# EAGLE schematic KAC12040_sfe_v0.3 (EAGLE 6.5.2)

## Sheet 1 of 6
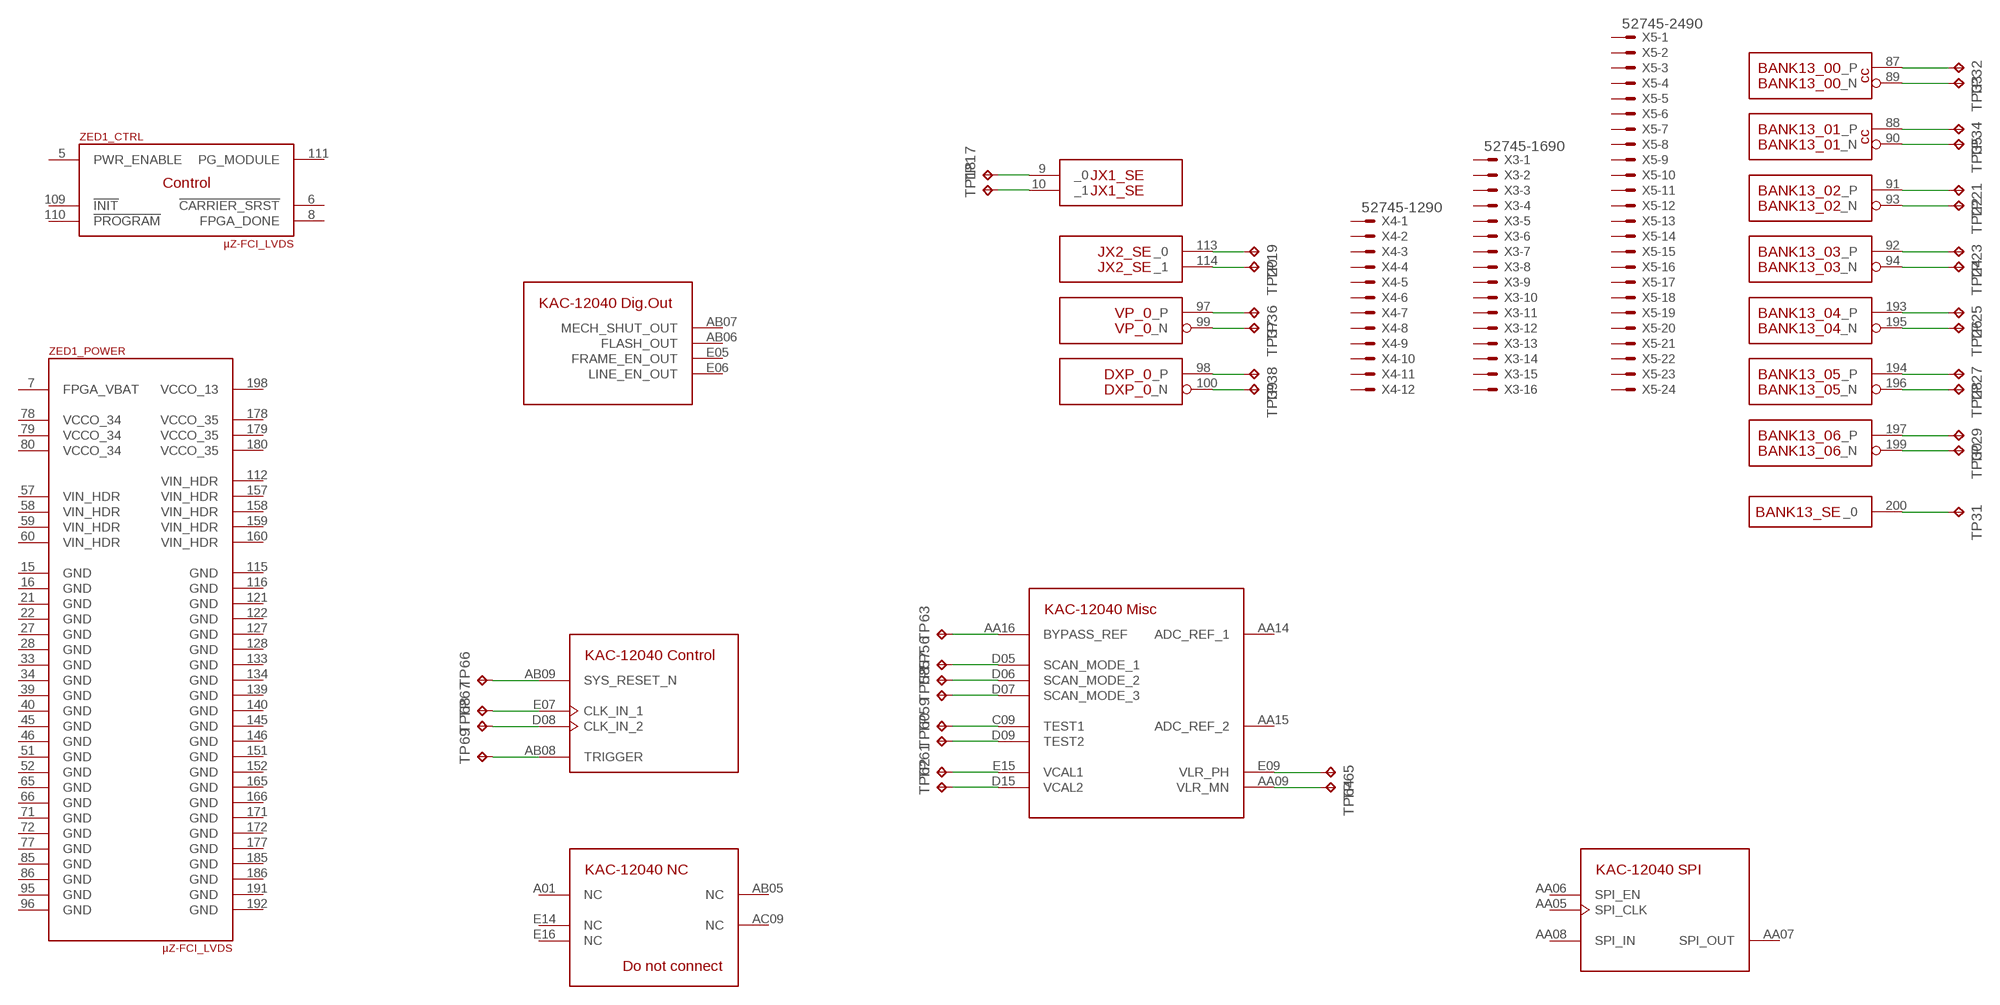
[diagram p0: schematic, sheet 1]

### Parts
TP17  TPPAD1-13  [P1-13]
TP18  TPPAD1-13  [P1-13]
TP19  TPPAD1-13  [P1-13]
TP20  TPPAD1-13  [P1-13]
TP21  TPTP08SQ  [TP08SQ]
TP22  TPTP08SQ  [TP08SQ]
TP23  TPTP08SQ  [TP08SQ]
TP24  TPTP08SQ  [TP08SQ]
TP25  TPTP08SQ  [TP08SQ]
TP26  TPTP08SQ  [TP08SQ]
TP27  TPTP08SQ  [TP08SQ]
TP28  TPTP08SQ  [TP08SQ]
TP29  TPTP08SQ  [TP08SQ]
TP30  TPTP08SQ  [TP08SQ]
TP31  TPPAD1-13  [P1-13]
TP32  TPTP18SQ  [TP18SQ]
TP33  TPTP18SQ  [TP18SQ]
TP34  TPTP18SQ  [TP18SQ]
TP35  TPTP18SQ  [TP18SQ]
TP36  TPPAD1-13Y  [P1-13Y]
TP37  TPPAD1-13Y  [P1-13Y]
TP38  TPPAD1-13Y  [P1-13Y]
TP39  TPPAD1-13Y  [P1-13Y]
TP56  TPTP15SQ  [TP15SQ]
TP57  TPTP15SQ  [TP15SQ]
TP58  TPTP15SQ  [TP15SQ]
TP59  TPTP15SQ  [TP15SQ]
TP60  TPTP15SQ  [TP15SQ]
TP61  TPTP15SQ  [TP15SQ]
TP62  TPTP15SQ  [TP15SQ]
TP63  TPTP15SQ  [TP15SQ]
TP64  TPTP15SQ  [TP15SQ]
TP65  TPTP15SQ  [TP15SQ]
TP66  TPTP15R  [TP15R]
TP67  TPTP15R  [TP15R]
TP68  TPTP15R  [TP15R]
TP69  TPTP15R  [TP15R]
U$1  KAC-12040-RB501T4  [KAC-12040-RB501T4]
X3  52745-1690  [52745-1690]
X4  52745-1290  [52745-1290]
X5  52745-2490  [52745-2490]
ZED1  µZ-FCI_LVDS  [µZ]

### Nets
N$1 [LVDS]: TP62.TP U$1.D15(_MISC:VCAL2)
N$2 [LVDS]: TP61.TP U$1.E15(_MISC:VCAL1)
N$3 [LVDS]: TP60.TP U$1.D09(_MISC:TEST2)
N$4 [LVDS]: TP59.TP U$1.C09(_MISC:TEST1)
N$42 [LVDS]: TP19.TP ZED1.113(JX2_SE:_0)
N$43 [LVDS]: TP20.TP ZED1.114(JX2_SE:_1)
N$44 [LVDS]: TP17.TP ZED1.9(JX1_SE:_0)
N$45 [LVDS]: TP18.TP ZED1.10(JX1_SE:_1)
N$46 [LVDS]: TP21.TP ZED1.91(BANK13_02:_P)
N$47 [LVDS]: TP22.TP ZED1.93(BANK13_02:_N)
N$48 [LVDS]: TP23.TP ZED1.92(BANK13_03:_P)
N$49 [LVDS]: TP24.TP ZED1.94(BANK13_03:_N)
N$50 [LVDS]: TP25.TP ZED1.193(BANK13_04:_P)
N$51 [LVDS]: TP26.TP ZED1.195(BANK13_04:_N)
N$52 [LVDS]: TP27.TP ZED1.194(BANK13_05:_P)
N$53 [LVDS]: TP28.TP ZED1.196(BANK13_05:_N)
N$54 [LVDS]: TP29.TP ZED1.197(BANK13_06:_P)
N$55 [LVDS]: TP30.TP ZED1.199(BANK13_06:_N)
N$56 [LVDS]: TP31.TP ZED1.200(BANK13_SE:_0)
N$57 [LVDS]: TP32.TP ZED1.87(BANK13_00:_P)
N$58 [LVDS]: TP33.TP ZED1.89(BANK13_00:_N)
N$59 [LVDS]: TP34.TP ZED1.88(BANK13_01:_P)
N$60 [LVDS]: TP35.TP ZED1.90(BANK13_01:_N)
N$61 [LVDS]: TP36.TP ZED1.97(VP_0:_P)
N$62 [LVDS]: TP37.TP ZED1.99(VP_0:_N)
N$63 [LVDS]: TP38.TP ZED1.98(DXP_0:_P)
N$64 [LVDS]: TP39.TP ZED1.100(DXP_0:_N)
N$65 [LVDS]: TP58.TP U$1.D07(_MISC:SCAN_MODE_3)
N$66 [LVDS]: TP57.TP U$1.D06(_MISC:SCAN_MODE_2)
N$67 [LVDS]: TP56.TP U$1.D05(_MISC:SCAN_MODE_1)
N$84 [LVDS]: TP63.TP U$1.AA16(_MISC:BYPASS_REF)
N$85 [LVDS]: TP65.TP U$1.E09(_MISC:VLR_PH)
N$86 [LVDS]: TP64.TP U$1.AA09(_MISC:VLR_MN)
N$87 [LVDS]: TP66.TP U$1.AB09(_CTRL:SYS_RESET_N)
N$88 [LVDS]: TP67.TP U$1.E07(_CTRL:CLK_IN_1)
N$89 [LVDS]: TP68.TP U$1.D08(_CTRL:CLK_IN_2)
N$90 [LVDS]: TP69.TP U$1.AB08(_CTRL:TRIGGER)
Unconnected: U$1.A01(_NC:NC) U$1.A15(_BANK5:LVDS_0_P) U$1.A16(_BANK5:LVDS_1_P) U$1.A17(_BANK5:LVDS_2_P) U$1.A18(_BANK5:LVDS_3_P) U$1.A19(_BANK5:LVDS_4_P) U$1.A20(_BANK5:LVDS_5_P) U$1.A21(_BANK5:LVDS_6_P) U$1.A22(_BANK7:CLK_P) U$1.A23(_BANK7:LVDS_0_P) U$1.A24(_BANK7:LVDS_1_P) U$1.A25(_BANK7:LVDS_2_P) U$1.AA05(_SPI:SPI_CLK) U$1.AA06(_SPI:SPI_EN) U$1.AA07(_SPI:SPI_OUT) U$1.AA08(_SPI:SPI_IN) U$1.AA14(_MISC:ADC_REF_1) U$1.AA15(_MISC:ADC_REF_2) U$1.AA26(_BANK6:LVDS_6_P) U$1.AA27(_BANK6:LVDS_6_N) U$1.AB05(_NC:NC) U$1.AB06(_DIGOUT:FLASH_OUT) U$1.AB07(_DIGOUT:MECH_SHUT_OUT) U$1.AB26(_BANK6:LVDS_5_P) U$1.AB27(_BANK6:LVDS_5_N) U$1.AC09(_NC:NC) U$1.AC15(_BANK4:CLK_P) U$1.AC16(_BANK4:CLK_N) U$1.AC26(_BANK6:LVDS_4_P) U$1.AC27(_BANK6:LVDS_4_N) U$1.AD15(_BANK4:LVDS_0_N) U$1.AD16(_BANK4:LVDS_1_N) U$1.AD17(_BANK4:LVDS_2_N) U$1.AD18(_BANK4:LVDS_3_N) U$1.AD19(_BANK4:LVDS_4_N) U$1.AD20(_BANK4:LVDS_5_N) U$1.AD21(_BANK4:LVDS_6_N) U$1.AD22(_BANK6:CLK_N) U$1.AD23(_BANK6:LVDS_0_N) U$1.AD24(_BANK6:LVDS_1_N) U$1.AD25(_BANK6:LVDS_2_N) U$1.AD26(_BANK6:LVDS_3_P) U$1.AD27(_BANK6:LVDS_3_N) U$1.AE15(_BANK4:LVDS_0_P) U$1.AE16(_BANK4:LVDS_1_P) U$1.AE17(_BANK4:LVDS_2_P) U$1.AE18(_BANK4:LVDS_3_P) U$1.AE19(_BANK4:LVDS_4_P) U$1.AE20(_BANK4:LVDS_5_P) U$1.AE21(_BANK4:LVDS_6_P) U$1.AE22(_BANK6:CLK_P) U$1.AE23(_BANK6:LVDS_0_P) U$1.AE24(_BANK6:LVDS_1_P) U$1.AE25(_BANK6:LVDS_2_P) U$1.B15(_BANK5:LVDS_0_N) U$1.B16(_BANK5:LVDS_1_N) U$1.B17(_BANK5:LVDS_2_N) U$1.B18(_BANK5:LVDS_3_N) U$1.B19(_BANK5:LVDS_4_N) U$1.B20(_BANK5:LVDS_5_N) U$1.B21(_BANK5:LVDS_6_N) U$1.B22(_BANK7:CLK_N) U$1.B23(_BANK7:LVDS_0_N) U$1.B24(_BANK7:LVDS_1_N) U$1.B25(_BANK7:LVDS_2_N) U$1.B26(_BANK7:LVDS_3_N) U$1.B27(_BANK7:LVDS_3_P) U$1.C15(_BANK5:CLK_P) U$1.C16(_BANK5:CLK_N) U$1.C26(_BANK7:LVDS_4_N) U$1.C27(_BANK7:LVDS_4_P) U$1.D26(_BANK7:LVDS_5_N) U$1.D27(_BANK7:LVDS_5_P) U$1.E05(_DIGOUT:FRAME_EN_OUT) U$1.E06(_DIGOUT:LINE_EN_OUT) U$1.E14(_NC:NC) U$1.E16(_NC:NC) U$1.E26(_BANK7:LVDS_6_N) U$1.E27(_BANK7:LVDS_6_P) X3.1 X3.2 X3.3 X3.4 X3.5 X3.6 X3.7 X3.8 X3.9 X3.10 X3.11 X3.12 X3.13 X3.14 X3.15 X3.16 X4.1 X4.2 X4.3 X4.4 X4.5 X4.6 X4.7 X4.8 X4.9 X4.10 X4.11 X4.12 X5.1 X5.2 X5.3 X5.4 X5.5 X5.6 X5.7 X5.8 X5.9 X5.10 X5.11 X5.12 X5.13 X5.14 X5.15 X5.16 X5.17 X5.18 X5.19 X5.20 X5.21 X5.22 X5.23 X5.24 ZED1.5(_CTRL:PWR_ENABLE) ZED1.6(_CTRL:!CARRIER_SRST) ZED1.8(_CTRL:FPGA_DONE) ZED1.109(_CTRL:!INIT) ZED1.110(_CTRL:!PROGRAM) ZED1.111(_CTRL:PG_MODULE)

## Sheet 2 of 6
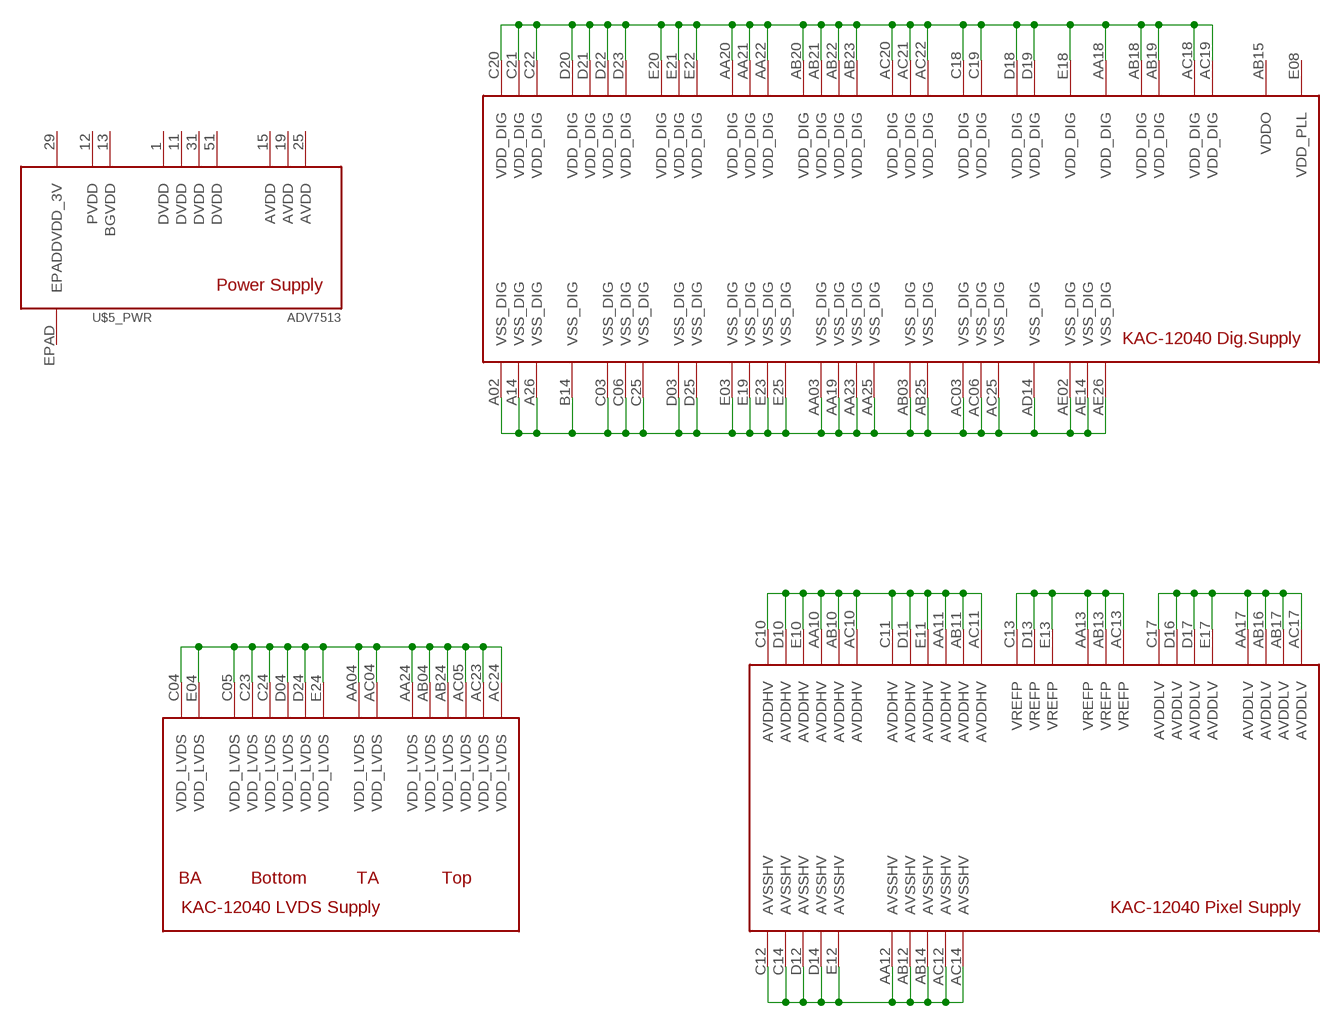
[diagram p1: schematic, sheet 2]

### Parts
U$5  ADV7513  [LQFP-ST-64-2]

### Nets
AVDD_HV: U$1.AA10(_PWR_PIXEL:AVDDHV) U$1.AA11(_PWR_PIXEL:AVDDHV) U$1.AB10(_PWR_PIXEL:AVDDHV) U$1.AB11(_PWR_PIXEL:AVDDHV) U$1.AC10(_PWR_PIXEL:AVDDHV) U$1.AC11(_PWR_PIXEL:AVDDHV) U$1.C10(_PWR_PIXEL:AVDDHV) U$1.C11(_PWR_PIXEL:AVDDHV) U$1.D10(_PWR_PIXEL:AVDDHV) U$1.D11(_PWR_PIXEL:AVDDHV) U$1.E10(_PWR_PIXEL:AVDDHV) U$1.E11(_PWR_PIXEL:AVDDHV)
AVDD_LV: U$1.AA17(_PWR_PIXEL:AVDDLV) U$1.AB16(_PWR_PIXEL:AVDDLV) U$1.AB17(_PWR_PIXEL:AVDDLV) U$1.AC17(_PWR_PIXEL:AVDDLV) U$1.C17(_PWR_PIXEL:AVDDLV) U$1.D16(_PWR_PIXEL:AVDDLV) U$1.D17(_PWR_PIXEL:AVDDLV) U$1.E17(_PWR_PIXEL:AVDDLV)
AVSS_HV: U$1.AA12(_PWR_PIXEL:AVSSHV) U$1.AB12(_PWR_PIXEL:AVSSHV) U$1.AB14(_PWR_PIXEL:AVSSHV) U$1.AC12(_PWR_PIXEL:AVSSHV) U$1.AC14(_PWR_PIXEL:AVSSHV) U$1.C12(_PWR_PIXEL:AVSSHV) U$1.C14(_PWR_PIXEL:AVSSHV) U$1.D12(_PWR_PIXEL:AVSSHV) U$1.D14(_PWR_PIXEL:AVSSHV) U$1.E12(_PWR_PIXEL:AVSSHV)
VDD_DIG: U$1.AA18(_PWR_DIG:VDD_DIG) U$1.AA20(_PWR_DIG:VDD_DIG) U$1.AA21(_PWR_DIG:VDD_DIG) U$1.AA22(_PWR_DIG:VDD_DIG) U$1.AB18(_PWR_DIG:VDD_DIG) U$1.AB19(_PWR_DIG:VDD_DIG) U$1.AB20(_PWR_DIG:VDD_DIG) U$1.AB21(_PWR_DIG:VDD_DIG) U$1.AB22(_PWR_DIG:VDD_DIG) U$1.AB23(_PWR_DIG:VDD_DIG) U$1.AC18(_PWR_DIG:VDD_DIG) U$1.AC19(_PWR_DIG:VDD_DIG) U$1.AC20(_PWR_DIG:VDD_DIG) U$1.AC21(_PWR_DIG:VDD_DIG) U$1.AC22(_PWR_DIG:VDD_DIG) U$1.C18(_PWR_DIG:VDD_DIG) U$1.C19(_PWR_DIG:VDD_DIG) U$1.C20(_PWR_DIG:VDD_DIG) U$1.C21(_PWR_DIG:VDD_DIG) U$1.C22(_PWR_DIG:VDD_DIG) U$1.D18(_PWR_DIG:VDD_DIG) U$1.D19(_PWR_DIG:VDD_DIG) U$1.D20(_PWR_DIG:VDD_DIG) U$1.D21(_PWR_DIG:VDD_DIG) U$1.D22(_PWR_DIG:VDD_DIG) U$1.D23(_PWR_DIG:VDD_DIG) U$1.E18(_PWR_DIG:VDD_DIG) U$1.E20(_PWR_DIG:VDD_DIG) U$1.E21(_PWR_DIG:VDD_DIG) U$1.E22(_PWR_DIG:VDD_DIG)
VDD_LVDS: U$1.AA04(_PWR_LVDS:VDD_LVDS) U$1.AA24(_PWR_LVDS:VDD_LVDS) U$1.AB04(_PWR_LVDS:VDD_LVDS) U$1.AB24(_PWR_LVDS:VDD_LVDS) U$1.AC04(_PWR_LVDS:VDD_LVDS) U$1.AC05(_PWR_LVDS:VDD_LVDS) U$1.AC23(_PWR_LVDS:VDD_LVDS) U$1.AC24(_PWR_LVDS:VDD_LVDS) U$1.C04(_PWR_LVDS:VDD_LVDS) U$1.C05(_PWR_LVDS:VDD_LVDS) U$1.C23(_PWR_LVDS:VDD_LVDS) U$1.C24(_PWR_LVDS:VDD_LVDS) U$1.D04(_PWR_LVDS:VDD_LVDS) U$1.D24(_PWR_LVDS:VDD_LVDS) U$1.E04(_PWR_LVDS:VDD_LVDS) U$1.E24(_PWR_LVDS:VDD_LVDS)
VREFP: U$1.AA13(_PWR_PIXEL:VREFP) U$1.AB13(_PWR_PIXEL:VREFP) U$1.AC13(_PWR_PIXEL:VREFP) U$1.C13(_PWR_PIXEL:VREFP) U$1.D13(_PWR_PIXEL:VREFP) U$1.E13(_PWR_PIXEL:VREFP)
VSS_DIG: U$1.A02(_PWR_DIG:VSS_DIG) U$1.A14(_PWR_DIG:VSS_DIG) U$1.A26(_PWR_DIG:VSS_DIG) U$1.AA03(_PWR_DIG:VSS_DIG) U$1.AA19(_PWR_DIG:VSS_DIG) U$1.AA23(_PWR_DIG:VSS_DIG) U$1.AA25(_PWR_DIG:VSS_DIG) U$1.AB03(_PWR_DIG:VSS_DIG) U$1.AB25(_PWR_DIG:VSS_DIG) U$1.AC03(_PWR_DIG:VSS_DIG) U$1.AC06(_PWR_DIG:VSS_DIG) U$1.AC25(_PWR_DIG:VSS_DIG) U$1.AD14(_PWR_DIG:VSS_DIG) U$1.AE02(_PWR_DIG:VSS_DIG) U$1.AE14(_PWR_DIG:VSS_DIG) U$1.AE26(_PWR_DIG:VSS_DIG) U$1.B14(_PWR_DIG:VSS_DIG) U$1.C03(_PWR_DIG:VSS_DIG) U$1.C06(_PWR_DIG:VSS_DIG) U$1.C25(_PWR_DIG:VSS_DIG) U$1.D03(_PWR_DIG:VSS_DIG) U$1.D25(_PWR_DIG:VSS_DIG) U$1.E03(_PWR_DIG:VSS_DIG) U$1.E19(_PWR_DIG:VSS_DIG) U$1.E23(_PWR_DIG:VSS_DIG) U$1.E25(_PWR_DIG:VSS_DIG)

## Sheet 3 of 6
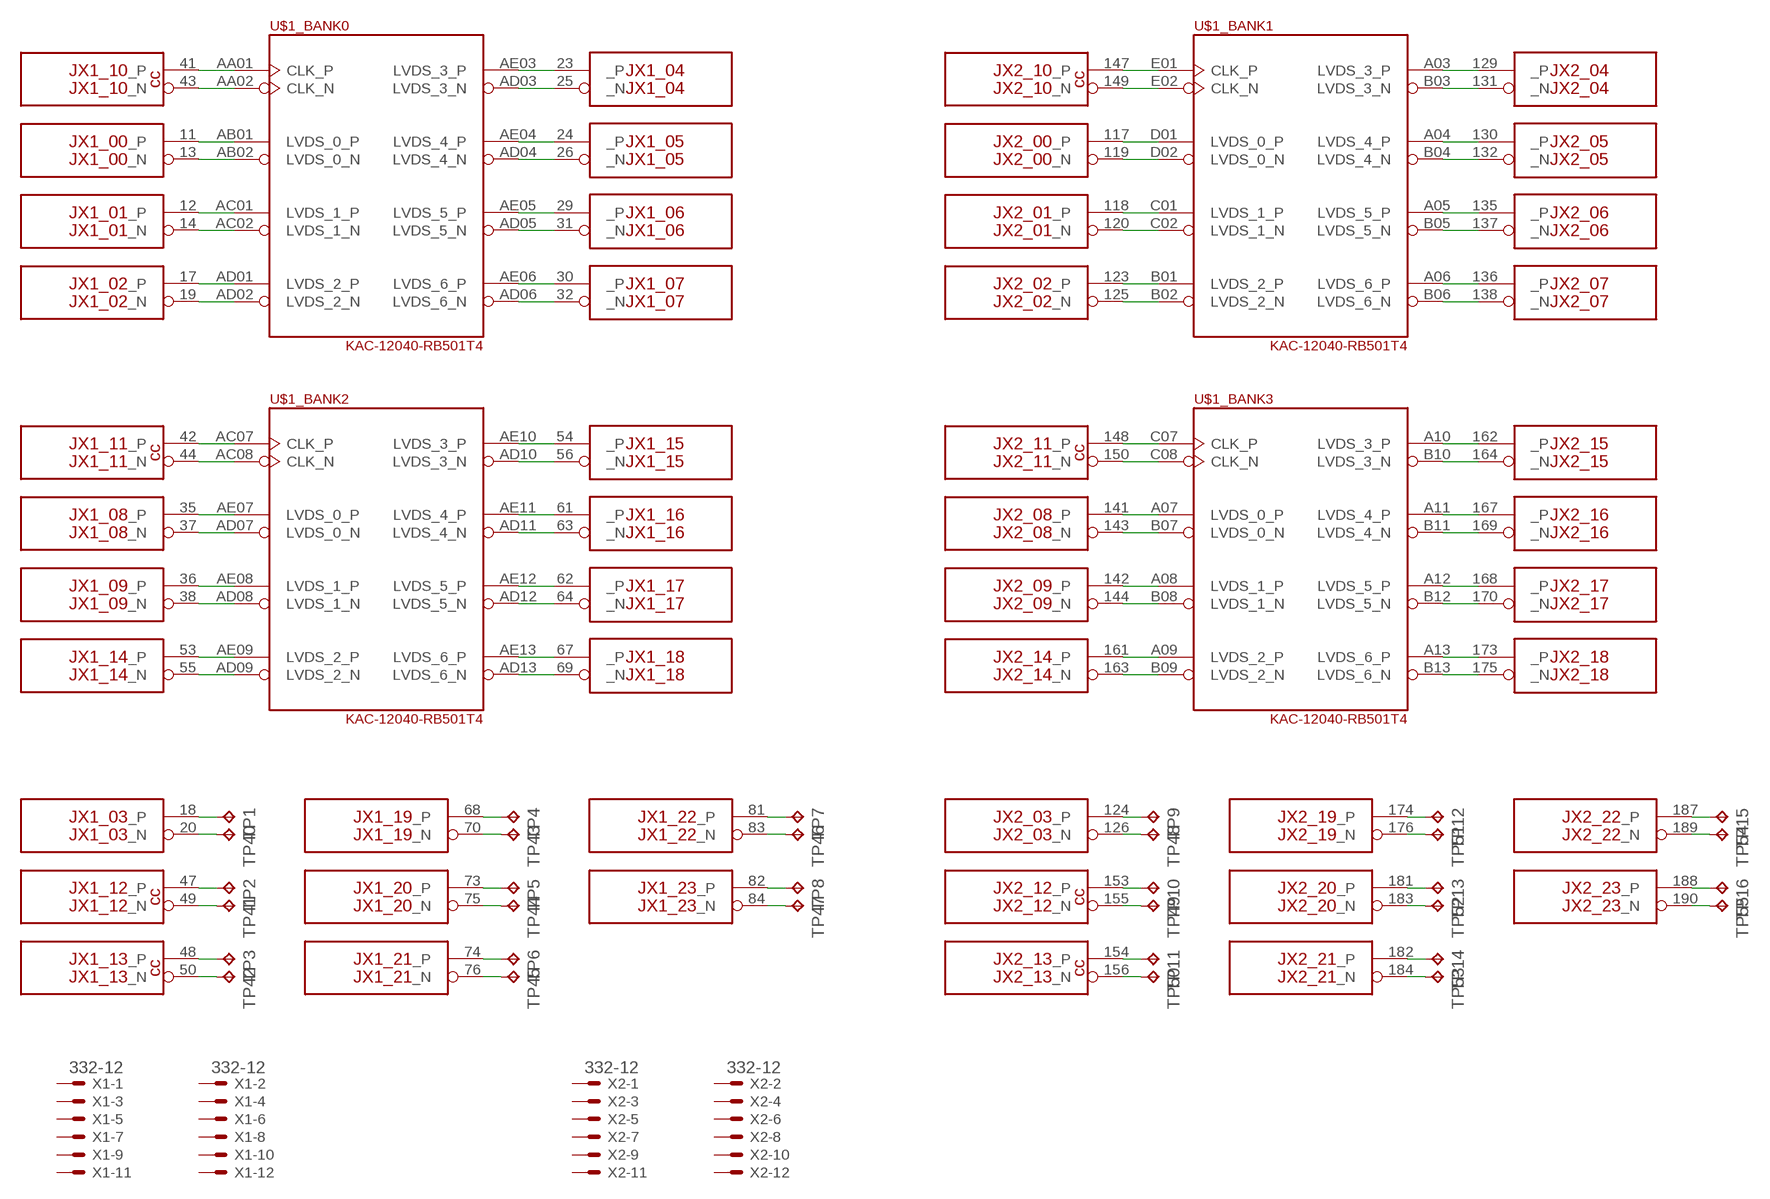
[diagram p2: schematic, sheet 3]

### Parts
TP1  TPTP10R  [TP10R]
TP2  TPTP20R  [TP20R]
TP3  TPTP20R  [TP20R]
TP4  TPTP10R  [TP10R]
TP5  TPTP10R  [TP10R]
TP6  TPTP10R  [TP10R]
TP7  TPTP10R  [TP10R]
TP8  TPTP10R  [TP10R]
TP9  TPTP10R  [TP10R]
TP10  TPTP20R  [TP20R]
TP11  TPTP20R  [TP20R]
TP12  TPTP10R  [TP10R]
TP13  TPTP10R  [TP10R]
TP14  TPTP10R  [TP10R]
TP15  TPTP10R  [TP10R]
TP16  TPTP10R  [TP10R]
TP40  TPTP10R  [TP10R]
TP41  TPTP20R  [TP20R]
TP42  TPTP20R  [TP20R]
TP43  TPTP10R  [TP10R]
TP44  TPTP10R  [TP10R]
TP45  TPTP10R  [TP10R]
TP46  TPTP10R  [TP10R]
TP47  TPTP10R  [TP10R]
TP48  TPTP10R  [TP10R]
TP49  TPTP20R  [TP20R]
TP50  TPTP20R  [TP20R]
TP51  TPTP10R  [TP10R]
TP52  TPTP10R  [TP10R]
TP53  TPTP10R  [TP10R]
TP54  TPTP10R  [TP10R]
TP55  TPTP10R  [TP10R]
X1  332-12  [332-12]
X2  332-12  [332-12]

### Nets
C$0_N [LVDS]: U$1.AA02(_BANK0:CLK_N) ZED1.43(JX1_10:_N)
C$0_P [LVDS]: U$1.AA01(_BANK0:CLK_P) ZED1.41(JX1_10:_P)
C$1_N [LVDS]: U$1.E02(_BANK1:CLK_N) ZED1.149(JX2_10:_N)
C$1_P [LVDS]: U$1.E01(_BANK1:CLK_P) ZED1.147(JX2_10:_P)
C$2_N [LVDS]: U$1.AC08(_BANK2:CLK_N) ZED1.44(JX1_11:_N)
C$2_P [LVDS]: U$1.AC07(_BANK2:CLK_P) ZED1.42(JX1_11:_P)
C$3_N [LVDS]: U$1.C08(_BANK3:CLK_N) ZED1.150(JX2_11:_N)
C$3_P [LVDS]: U$1.C07(_BANK3:CLK_P) ZED1.148(JX2_11:_P)
L0$0_N [LVDS]: U$1.AB02(_BANK0:LVDS_0_N) ZED1.13(JX1_00:_N)
L0$0_P [LVDS]: U$1.AB01(_BANK0:LVDS_0_P) ZED1.11(JX1_00:_P)
L0$1_N [LVDS]: U$1.D02(_BANK1:LVDS_0_N) ZED1.119(JX2_00:_N)
L0$1_P [LVDS]: U$1.D01(_BANK1:LVDS_0_P) ZED1.117(JX2_00:_P)
L0$2_N [LVDS]: U$1.AD07(_BANK2:LVDS_0_N) ZED1.37(JX1_08:_N)
L0$2_P [LVDS]: U$1.AE07(_BANK2:LVDS_0_P) ZED1.35(JX1_08:_P)
L0$3_N [LVDS]: U$1.B07(_BANK3:LVDS_0_N) ZED1.143(JX2_08:_N)
L0$3_P [LVDS]: U$1.A07(_BANK3:LVDS_0_P) ZED1.141(JX2_08:_P)
L1$0_N [LVDS]: U$1.AC02(_BANK0:LVDS_1_N) ZED1.14(JX1_01:_N)
L1$0_P [LVDS]: U$1.AC01(_BANK0:LVDS_1_P) ZED1.12(JX1_01:_P)
L1$1_N [LVDS]: U$1.C02(_BANK1:LVDS_1_N) ZED1.120(JX2_01:_N)
L1$1_P [LVDS]: U$1.C01(_BANK1:LVDS_1_P) ZED1.118(JX2_01:_P)
L1$2_N [LVDS]: U$1.AD08(_BANK2:LVDS_1_N) ZED1.38(JX1_09:_N)
L1$2_P [LVDS]: U$1.AE08(_BANK2:LVDS_1_P) ZED1.36(JX1_09:_P)
L1$3_N [LVDS]: U$1.B08(_BANK3:LVDS_1_N) ZED1.144(JX2_09:_N)
L1$3_P [LVDS]: U$1.A08(_BANK3:LVDS_1_P) ZED1.142(JX2_09:_P)
L2$0_N [LVDS]: U$1.AD02(_BANK0:LVDS_2_N) ZED1.19(JX1_02:_N)
L2$0_P [LVDS]: U$1.AD01(_BANK0:LVDS_2_P) ZED1.17(JX1_02:_P)
L2$1_N [LVDS]: U$1.B02(_BANK1:LVDS_2_N) ZED1.125(JX2_02:_N)
L2$1_P [LVDS]: U$1.B01(_BANK1:LVDS_2_P) ZED1.123(JX2_02:_P)
L2$2_N [LVDS]: U$1.AD09(_BANK2:LVDS_2_N) ZED1.55(JX1_14:_N)
L2$2_P [LVDS]: U$1.AE09(_BANK2:LVDS_2_P) ZED1.53(JX1_14:_P)
L2$3_N [LVDS]: U$1.B09(_BANK3:LVDS_2_N) ZED1.163(JX2_14:_N)
L2$3_P [LVDS]: U$1.A09(_BANK3:LVDS_2_P) ZED1.161(JX2_14:_P)
L3$0_N [LVDS]: U$1.AD03(_BANK0:LVDS_3_N) ZED1.25(JX1_04:_N)
L3$0_P [LVDS]: U$1.AE03(_BANK0:LVDS_3_P) ZED1.23(JX1_04:_P)
L3$1_N [LVDS]: U$1.B03(_BANK1:LVDS_3_N) ZED1.131(JX2_04:_N)
L3$1_P [LVDS]: U$1.A03(_BANK1:LVDS_3_P) ZED1.129(JX2_04:_P)
L3$2_N [LVDS]: U$1.AD10(_BANK2:LVDS_3_N) ZED1.56(JX1_15:_N)
L3$2_P [LVDS]: U$1.AE10(_BANK2:LVDS_3_P) ZED1.54(JX1_15:_P)
L3$3_N [LVDS]: U$1.B10(_BANK3:LVDS_3_N) ZED1.164(JX2_15:_N)
L3$3_P [LVDS]: U$1.A10(_BANK3:LVDS_3_P) ZED1.162(JX2_15:_P)
L4$0_N [LVDS]: U$1.AD04(_BANK0:LVDS_4_N) ZED1.26(JX1_05:_N)
L4$0_P [LVDS]: U$1.AE04(_BANK0:LVDS_4_P) ZED1.24(JX1_05:_P)
L4$1_N [LVDS]: U$1.B04(_BANK1:LVDS_4_N) ZED1.132(JX2_05:_N)
L4$1_P [LVDS]: U$1.A04(_BANK1:LVDS_4_P) ZED1.130(JX2_05:_P)
L4$2_N [LVDS]: U$1.AD11(_BANK2:LVDS_4_N) ZED1.63(JX1_16:_N)
L4$2_P [LVDS]: U$1.AE11(_BANK2:LVDS_4_P) ZED1.61(JX1_16:_P)
L4$3_N [LVDS]: U$1.B11(_BANK3:LVDS_4_N) ZED1.169(JX2_16:_N)
L4$3_P [LVDS]: U$1.A11(_BANK3:LVDS_4_P) ZED1.167(JX2_16:_P)
L5$0_N [LVDS]: U$1.AD05(_BANK0:LVDS_5_N) ZED1.31(JX1_06:_N)
L5$0_P [LVDS]: U$1.AE05(_BANK0:LVDS_5_P) ZED1.29(JX1_06:_P)
L5$1_N [LVDS]: U$1.B05(_BANK1:LVDS_5_N) ZED1.137(JX2_06:_N)
L5$1_P [LVDS]: U$1.A05(_BANK1:LVDS_5_P) ZED1.135(JX2_06:_P)
L5$2_N [LVDS]: U$1.AD12(_BANK2:LVDS_5_N) ZED1.64(JX1_17:_N)
L5$2_P [LVDS]: U$1.AE12(_BANK2:LVDS_5_P) ZED1.62(JX1_17:_P)
L5$3_N [LVDS]: U$1.B12(_BANK3:LVDS_5_N) ZED1.170(JX2_17:_N)
L5$3_P [LVDS]: U$1.A12(_BANK3:LVDS_5_P) ZED1.168(JX2_17:_P)
L6$0_N [LVDS]: U$1.AD06(_BANK0:LVDS_6_N) ZED1.32(JX1_07:_N)
L6$0_P [LVDS]: U$1.AE06(_BANK0:LVDS_6_P) ZED1.30(JX1_07:_P)
L6$1_N [LVDS]: U$1.B06(_BANK1:LVDS_6_N) ZED1.138(JX2_07:_N)
L6$1_P [LVDS]: U$1.A06(_BANK1:LVDS_6_P) ZED1.136(JX2_07:_P)
L6$2_N [LVDS]: U$1.AD13(_BANK2:LVDS_6_N) ZED1.69(JX1_18:_N)
L6$2_P [LVDS]: U$1.AE13(_BANK2:LVDS_6_P) ZED1.67(JX1_18:_P)
L6$3_N [LVDS]: U$1.B13(_BANK3:LVDS_6_N) ZED1.175(JX2_18:_N)
L6$3_P [LVDS]: U$1.A13(_BANK3:LVDS_6_P) ZED1.173(JX2_18:_P)
N$21 [LVDS]: TP15.TP ZED1.187(JX2_22:_P)
N$22 [LVDS]: TP12.TP ZED1.174(JX2_19:_P)
N$23 [LVDS]: TP9.TP ZED1.124(JX2_03:_P)
N$24 [LVDS]: TP7.TP ZED1.81(JX1_22:_P)
N$25 [LVDS]: TP4.TP ZED1.68(JX1_19:_P)
N$26 [LVDS]: TP1.TP ZED1.18(JX1_03:_P)
N$31 [LVDS]: TP2.TP ZED1.47(JX1_12:_P)
N$33 [LVDS]: TP3.TP ZED1.48(JX1_13:_P)
N$34 [LVDS]: TP5.TP ZED1.73(JX1_20:_P)
N$35 [LVDS]: TP6.TP ZED1.74(JX1_21:_P)
N$36 [LVDS]: TP8.TP ZED1.82(JX1_23:_P)
N$37 [LVDS]: TP10.TP ZED1.153(JX2_12:_P)
N$38 [LVDS]: TP11.TP ZED1.154(JX2_13:_P)
N$39 [LVDS]: TP13.TP ZED1.181(JX2_20:_P)
N$40 [LVDS]: TP14.TP ZED1.182(JX2_21:_P)
N$41 [LVDS]: TP16.TP ZED1.188(JX2_23:_P)
N$68 [LVDS]: TP40.TP ZED1.20(JX1_03:_N)
N$69 [LVDS]: TP41.TP ZED1.49(JX1_12:_N)
N$70 [LVDS]: TP42.TP ZED1.50(JX1_13:_N)
N$71 [LVDS]: TP43.TP ZED1.70(JX1_19:_N)
N$72 [LVDS]: TP44.TP ZED1.75(JX1_20:_N)
N$73 [LVDS]: TP45.TP ZED1.76(JX1_21:_N)
N$74 [LVDS]: TP46.TP ZED1.83(JX1_22:_N)
N$75 [LVDS]: TP47.TP ZED1.84(JX1_23:_N)
N$76 [LVDS]: TP48.TP ZED1.126(JX2_03:_N)
N$77 [LVDS]: TP49.TP ZED1.155(JX2_12:_N)
N$78 [LVDS]: TP50.TP ZED1.156(JX2_13:_N)
N$79 [LVDS]: TP51.TP ZED1.176(JX2_19:_N)
N$80 [LVDS]: TP52.TP ZED1.183(JX2_20:_N)
N$81 [LVDS]: TP53.TP ZED1.184(JX2_21:_N)
N$82 [LVDS]: TP54.TP ZED1.189(JX2_22:_N)
N$83 [LVDS]: TP55.TP ZED1.190(JX2_23:_N)
Unconnected: X1.1 X1.2 X1.3 X1.4 X1.5 X1.6 X1.7 X1.8 X1.9 X1.10 X1.11 X1.12 X2.1 X2.2 X2.3 X2.4 X2.5 X2.6 X2.7 X2.8 X2.9 X2.10 X2.11 X2.12

## Sheet 4 of 6
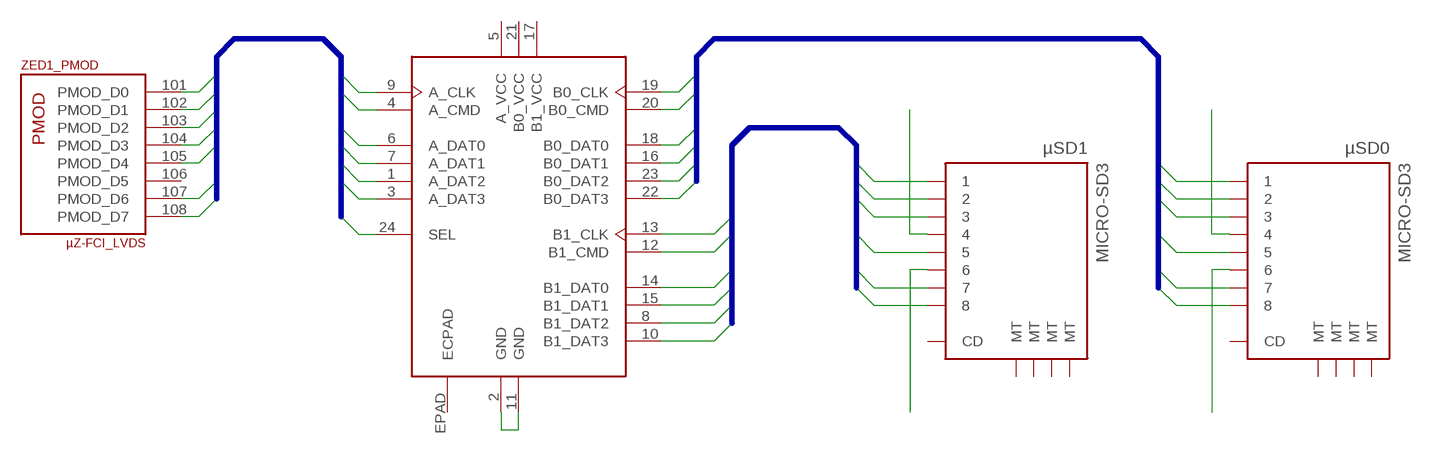
[diagram p3: schematic, sheet 4]

### Parts
U$4  TXS02612  [S-PWQFN-N24]
µSD0  MICRO-SD3  [TF-MICRO-SD_PP3]
µSD1  MICRO-SD3  [TF-MICRO-SD_PP3]

### Nets
A_CLK: U$4.9(A_CLK) ZED1.104(_PMOD:PMOD_D3)
A_CMD: U$4.4(A_CMD) ZED1.103(_PMOD:PMOD_D2)
A_DAT0: U$4.6(A_DAT0) ZED1.102(_PMOD:PMOD_D1)
A_DAT1: U$4.7(A_DAT1) ZED1.101(_PMOD:PMOD_D0)
A_DAT2: U$4.1(A_DAT2) ZED1.107(_PMOD:PMOD_D6)
A_DAT3: U$4.3(A_DAT3) ZED1.108(_PMOD:PMOD_D7)
B0_CLK: U$4.19(B0_CLK) µSD0.5
B0_CMD: U$4.20(B0_CMD) µSD0.3
B0_DAT0: U$4.18(B0_DAT0) µSD0.7
B0_DAT1: U$4.16(B0_DAT1) µSD0.8
B0_DAT2: U$4.23(B0_DAT2) µSD0.1
B0_DAT3: U$4.22(B0_DAT3) µSD0.2
B1_CLK: U$4.13(B1_CLK) µSD1.5
B1_CMD: U$4.12(B1_CMD) µSD1.3
B1_DAT0: U$4.14(B1_DAT0) µSD1.7
B1_DAT1: U$4.15(B1_DAT1) µSD1.8
B1_DAT2: U$4.8(B1_DAT2) µSD1.1
B1_DAT3: U$4.10(B1_DAT3) µSD1.2
N$5: µSD0.4
N$6: µSD0.6
N$7: µSD1.6
N$8: µSD1.4
N$30: U$4.2(GND) U$4.11(GND)
SEL: U$4.24(SEL) ZED1.105(_PMOD:PMOD_D4)
Unconnected: ZED1.106(_PMOD:PMOD_D5) µSD0.CD µSD1.CD

### Buses
B0_CLK,B0_CMD,B0_DAT[0..3]
B1_CLK,B1_CMD,B1_DAT[0..3]
A_CLK,A_CMD,A_DAT[0..3],SEL

## Sheet 5 of 6
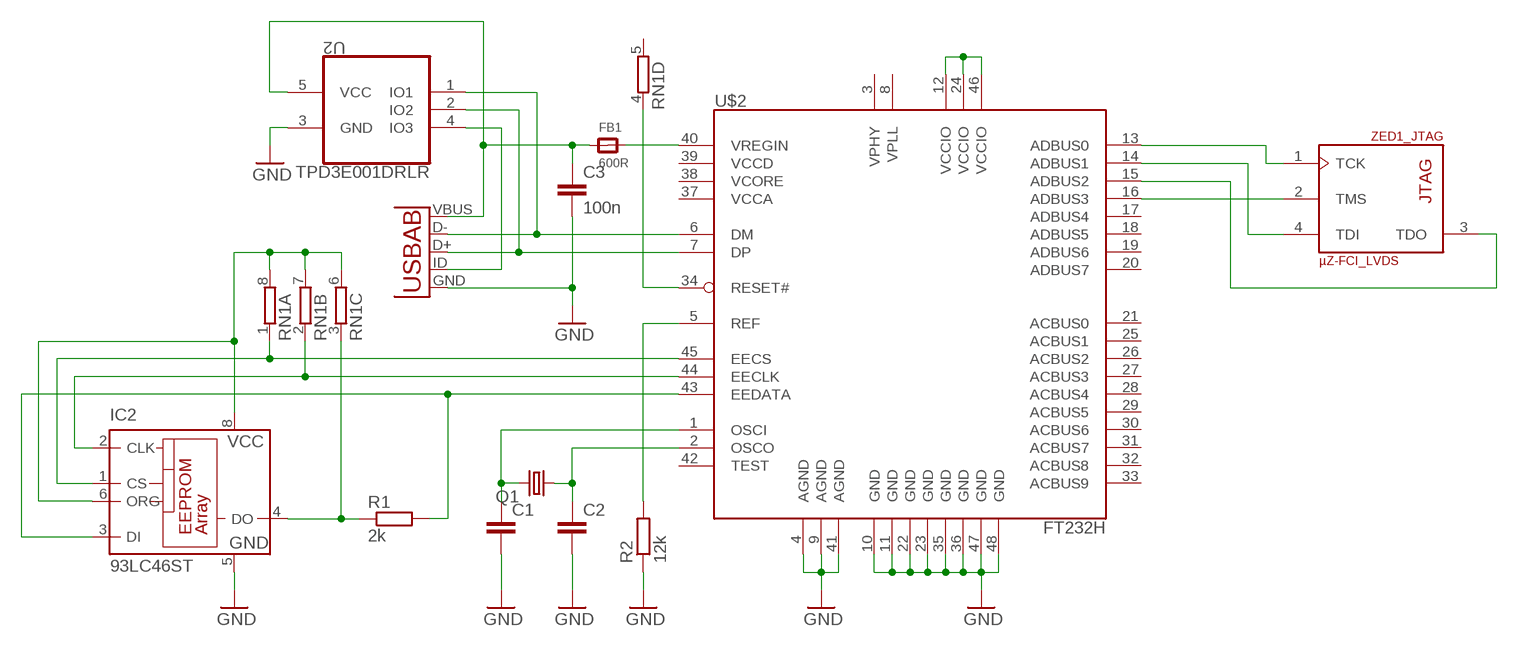
[diagram p4: schematic, sheet 5]

### Parts
C1  C-EUC0402K  [C0402K]
C2  C-EUC0402K  [C0402K]
C3  100n  C-EUC0402K  [C0402K]
FB1  600R  FERRITE_0603MP  [_0603MP]
IC2  93LC46ST  [TSSOP8]
Q1  CRYSTALCTS406  [CTS406]
R1  2k  R-EU_R0402  [R0402]
R2  12k  R-EU_R0402  [R0402]
RN1  4R-N0402ARV341  [4X0402ARV341]
U1  USB-AB  [USB-AB-MICRO-SMD]
U2  TPD3E001DRLR  [SOT50P160X60-5N]
U$2  FT232H  [LQFP48]

### Nets
EE_CLK: IC2.2(CLK) RN1.2 U$2.44(EECLK)
EE_CS: IC2.1(CS) RN1.1 U$2.45(EECS)
EE_DATA: IC2.3(DI) R1.2 U$2.43(EEDATA)
GND: C1.2 C2.2 C3.2 IC2.5(GND) R2.1 U1.GND U2.3(GND) U$2.4(AGND) U$2.9(AGND) U$2.10(GND) U$2.11(GND) U$2.22(GND) U$2.23(GND) U$2.35(GND) U$2.36(GND) U$2.41(AGND) U$2.47(GND) U$2.48(GND)
N$9: FB1.2 U$2.40(VREGIN)
N$10: C3.1 FB1.1 U1.VBUS U2.5(VCC)
N$11: IC2.4(DO) R1.1 RN1.3
N$12: IC2.6(ORG) IC2.8(VCC) RN1.6 RN1.7 RN1.8
N$13: U$2.13(ADBUS0) ZED1.1(_JTAG:TCK)
N$14: C1.1 Q1.3 U$2.1(OSCI)
N$15: C2.1 Q1.1 U$2.2(OSCO)
N$16: U$2.14(ADBUS1) ZED1.4(_JTAG:TDI)
N$17: U$2.15(ADBUS2) ZED1.3(_JTAG:TDO)
N$18: U$2.16(ADBUS3) ZED1.2(_JTAG:TMS)
N$19: U$2.12(VCCIO) U$2.24(VCCIO) U$2.46(VCCIO)
N$20: U1.ID(USBID) U2.4(IO3)
N$27: RN1.4 U$2.34(RESET#)
N$28: U1.D+ U2.2(IO2) U$2.7(DP)
N$29: U1.D- U2.1(IO1) U$2.6(DM)
N$32: R2.2 U$2.5(REF)
Unconnected: IC2.7(NU) RN1.5 U$2.17(ADBUS4) U$2.18(ADBUS5) U$2.19(ADBUS6) U$2.20(ADBUS7) U$2.21(ACBUS0) U$2.25(ACBUS1) U$2.26(ACBUS2) U$2.27(ACBUS3) U$2.28(ACBUS4) U$2.29(ACBUS5) U$2.30(ACBUS6) U$2.31(ACBUS7) U$2.32(ACBUS8) U$2.33(ACBUS9) U$2.37(VCCA) U$2.38(VCORE) U$2.42(TEST)

## Sheet 6 of 6
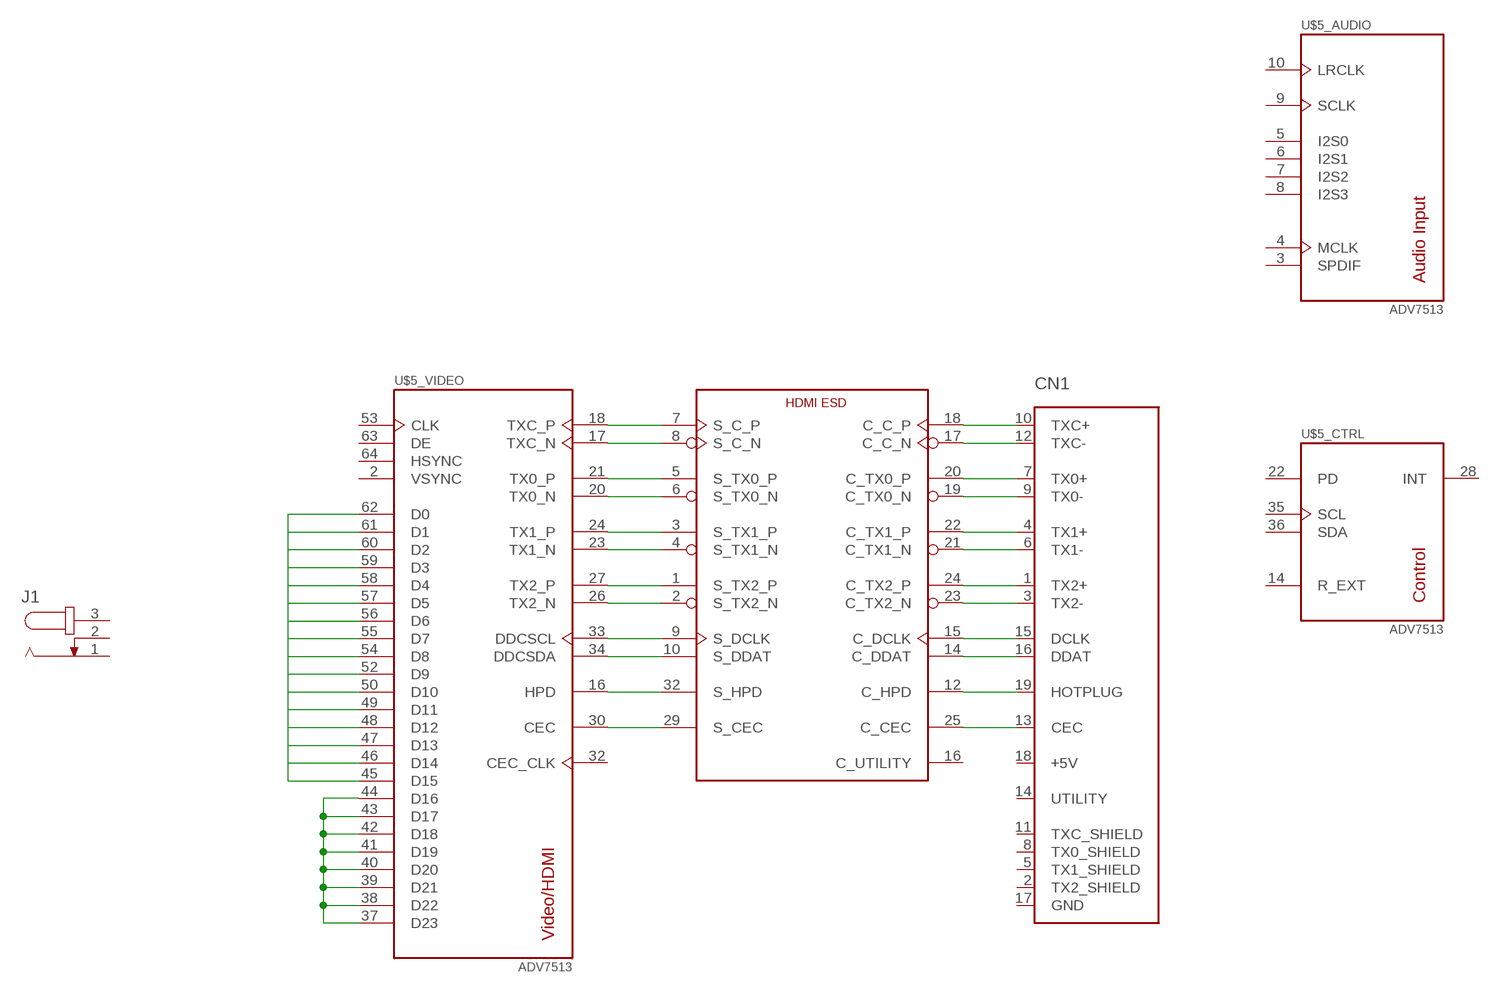
[diagram p5: schematic, sheet 6]

### Parts
CN1  HDMI_MOLEX_47151-0001  [HDMI_MOLEX_47151-0001]
J1  JACK-PLUG0  [SPC4077]
U$3  IP4786CZ32SOT617-3  [SOT617-3]

### Nets
N$91: U$3.7(S_C_P) U$5.18(_VIDEO:TXC_P)
N$92: U$3.8(S_C_N) U$5.17(_VIDEO:TXC_N)
N$93: U$3.5(S_TX0_P) U$5.21(_VIDEO:TX0_P)
N$94: U$3.6(S_TX0_N) U$5.20(_VIDEO:TX0_N)
N$95: U$3.3(S_TX1_P) U$5.24(_VIDEO:TX1_P)
N$96: U$3.4(S_TX1_N) U$5.23(_VIDEO:TX1_N)
N$97: U$3.1(S_TX2_P) U$5.27(_VIDEO:TX2_P)
N$98: U$3.2(S_TX2_N) U$5.26(_VIDEO:TX2_N)
N$99: U$3.9(S_DCLK) U$5.33(_VIDEO:DDCSCL)
N$100: U$3.10(S_DDAT) U$5.34(_VIDEO:DDCSDA)
N$101: U$3.32(S_HPD) U$5.16(_VIDEO:HPD)
N$102: U$3.29(S_CEC) U$5.30(_VIDEO:CEC)
N$103: CN1.13(CEC) U$3.25(C_CEC)
N$104: CN1.19(HOTPLUG) U$3.12(C_HPD)
N$105: CN1.16(DDAT) U$3.14(C_DDAT)
N$106: CN1.15(DCLK) U$3.15(C_DCLK)
N$107: CN1.3(TX2-) U$3.23(C_TX2_N)
N$108: CN1.1(TX2+) U$3.24(C_TX2_P)
N$109: CN1.6(TX1-) U$3.21(C_TX1_N)
N$110: CN1.4(TX1+) U$3.22(C_TX1_P)
N$111: CN1.9(TX0-) U$3.19(C_TX0_N)
N$112: CN1.7(TX0+) U$3.20(C_TX0_P)
N$113: CN1.12(TXC-) U$3.17(C_C_N)
N$114: CN1.10(TXC+) U$3.18(C_C_P)
N$115: U$5.45(_VIDEO:D15) U$5.46(_VIDEO:D14) U$5.47(_VIDEO:D13) U$5.48(_VIDEO:D12) U$5.49(_VIDEO:D11) U$5.50(_VIDEO:D10) U$5.52(_VIDEO:D9) U$5.54(_VIDEO:D8) U$5.55(_VIDEO:D7) U$5.56(_VIDEO:D6) U$5.57(_VIDEO:D5) U$5.58(_VIDEO:D4) U$5.59(_VIDEO:D3) U$5.60(_VIDEO:D2) U$5.61(_VIDEO:D1) U$5.62(_VIDEO:D0)
N$116: U$5.37(_VIDEO:D23) U$5.38(_VIDEO:D22) U$5.39(_VIDEO:D21) U$5.40(_VIDEO:D20) U$5.41(_VIDEO:D19) U$5.42(_VIDEO:D18) U$5.43(_VIDEO:D17) U$5.44(_VIDEO:D16)
Unconnected: CN1.14(UTILITY) J1.1 J1.2 J1.3 U$3.16(C_UTILITY) U$3.26(ESD_BYPASS) U$3.28(CEC_STBY) U$3.30(NC) U$3.31(NC) U$5.2(_VIDEO:VSYNC) U$5.3(_AUDIO:SPDIF) U$5.4(_AUDIO:MCLK) U$5.5(_AUDIO:I2S0) U$5.6(_AUDIO:I2S1) U$5.7(_AUDIO:I2S2) U$5.8(_AUDIO:I2S3) U$5.9(_AUDIO:SCLK) U$5.10(_AUDIO:LRCLK) U$5.14(_CTRL:R_EXT) U$5.22(_CTRL:PD) U$5.28(_CTRL:INT) U$5.32(_VIDEO:CEC_CLK) U$5.35(_CTRL:SCL) U$5.36(_CTRL:SDA) U$5.53(_VIDEO:CLK) U$5.63(_VIDEO:DE) U$5.64(_VIDEO:HSYNC)

## Power pins joined to a net without a drawn wire
+5V: CN1.18(+5V)
A_VCC: U$4.5(A_VCC)
AVDD: U$5.15(_PWR:AVDD) U$5.19(_PWR:AVDD) U$5.25(_PWR:AVDD)
B0_VCC: U$4.21(B0_VCC)
B1_VCC: U$4.17(B1_VCC)
BGVDD: U$5.13(_PWR:BGVDD)
C_5V: U$3.13(C_5V)
DVDD: U$5.1(_PWR:DVDD) U$5.11(_PWR:DVDD) U$5.31(_PWR:DVDD) U$5.51(_PWR:DVDD)
DVDD_3V: U$5.29(_PWR:DVDD_3V)
ECPAD: U$4.EPAD(ECPAD)
EPAD: U$3.EPAD U$5.EPAD(_PWR:EPAD)
FPGA_VBAT: ZED1.7(_POWER:FPGA_VBAT)
GND: CN1.17(GND) CN1.P$1(GND) CN1.P$2(GND) CN1.P$3(GND) CN1.P$4(GND) ZED1.15(_POWER:GND) ZED1.16(_POWER:GND) ZED1.21(_POWER:GND) ZED1.22(_POWER:GND) ZED1.27(_POWER:GND) ZED1.28(_POWER:GND) ZED1.33(_POWER:GND) ZED1.34(_POWER:GND) ZED1.39(_POWER:GND) ZED1.40(_POWER:GND) ZED1.45(_POWER:GND) ZED1.46(_POWER:GND) ZED1.51(_POWER:GND) ZED1.52(_POWER:GND) ZED1.65(_POWER:GND) ZED1.66(_POWER:GND) ZED1.71(_POWER:GND) ZED1.72(_POWER:GND) ZED1.77(_POWER:GND) ZED1.85(_POWER:GND) ZED1.86(_POWER:GND) ZED1.95(_POWER:GND) ZED1.96(_POWER:GND) ZED1.115(_POWER:GND) ZED1.116(_POWER:GND) ZED1.121(_POWER:GND) ZED1.122(_POWER:GND) ZED1.127(_POWER:GND) ZED1.128(_POWER:GND) ZED1.133(_POWER:GND) ZED1.134(_POWER:GND) ZED1.139(_POWER:GND) ZED1.140(_POWER:GND) ZED1.145(_POWER:GND) ZED1.146(_POWER:GND) ZED1.151(_POWER:GND) ZED1.152(_POWER:GND) ZED1.165(_POWER:GND) ZED1.166(_POWER:GND) ZED1.171(_POWER:GND) ZED1.172(_POWER:GND) ZED1.177(_POWER:GND) ZED1.185(_POWER:GND) ZED1.186(_POWER:GND) ZED1.191(_POWER:GND) ZED1.192(_POWER:GND)
MT: µSD0.MT1(MT) µSD0.MT2(MT) µSD0.MT3(MT) µSD0.MT4(MT) µSD1.MT1(MT) µSD1.MT2(MT) µSD1.MT3(MT) µSD1.MT4(MT)
PVDD: U$5.12(_PWR:PVDD)
S_VCC: U$3.27(S_VCC)
TX0_SHIELD: CN1.8(TX0_SHIELD)
TX1_SHIELD: CN1.5(TX1_SHIELD)
TX2_SHIELD: CN1.2(TX2_SHIELD)
TXC_SHIELD: CN1.11(TXC_SHIELD)
VCC5V: U$3.11(VCC5V)
VCCD: U$2.39(VCCD)
VCCO_13: ZED1.198(_POWER:VCCO_13)
VCCO_34: ZED1.78(_POWER:VCCO_34) ZED1.79(_POWER:VCCO_34) ZED1.80(_POWER:VCCO_34)
VCCO_35: ZED1.178(_POWER:VCCO_35) ZED1.179(_POWER:VCCO_35) ZED1.180(_POWER:VCCO_35)
VDD_PLL: U$1.E08(_PWR_DIG:VDD_PLL)
VDDO: U$1.AB15(_PWR_DIG:VDDO)
VIN_HDR: ZED1.57(_POWER:VIN_HDR) ZED1.58(_POWER:VIN_HDR) ZED1.59(_POWER:VIN_HDR) ZED1.60(_POWER:VIN_HDR) ZED1.112(_POWER:VIN_HDR) ZED1.157(_POWER:VIN_HDR) ZED1.158(_POWER:VIN_HDR) ZED1.159(_POWER:VIN_HDR) ZED1.160(_POWER:VIN_HDR)
VPHY: U$2.3(VPHY)
VPLL: U$2.8(VPLL)

## Library data of the parts
C1-C3 = rcl:C-EU: CAPACITOR, European symbol
CN1 = microbuilder:HDMI_MOLEX_47151-0001
FB1 = microbuilder:FERRITE: Ferrite Bead 0603 MMZ1608B121C - 120 Ohm @ 100MHz, 600mA, 0.15 Ohm DC Resistance - Digikey: 445-2164-1-ND BK1608HW121-T - 120 Ohm, 600mA Ferrite Chip - Digikey: 587-1876-2-ND 0805 HZ0805B272R-10 - 2.7K Ohm @ 100MHz, 200mA, 0.8 Ohm DC Resistance - Digikey: 240-2504-1-ND (see also Murata BLM21BD272SN1L) MMZ2012Y152B - 1.5K Ohm @ 100MHz, 500mA, 0.4 Ohm DC Resistance - Digikey: 445-1560-1-ND - Mainly for high frequency (80-400MHz) MMZ2012R102A - 1K Ohm @ 100MHz, 500mA, 0.3 Ohm DC Resistance - Digikey: 445-1555-2-ND - More general purpose (10-200MHz)
IC2 = microchip:93*: Serial EPROM 1 K/2 K/4 K, low voltage, Microwire; MF: MICROCHIP; MPN: 93LC46C-I/ST; OC_FARNELL: 1817225; OC_NEWARK: 30H4716
J1 = con-jack:JACK-PLUG: DC POWER JACK Power Jack, DC, Right Angle, Through Hole, Rated 5A at 16VDC, PC Terminals Distributor: Farnell (www.Farnell.de) Drawing: 84N1161.pdf / 84N1162.pdf Manufacturer: SPC Technology (www.spctechnology.com) Type: SPC4077 / SPC 4078; OC_FARNELL: unknown; OC_NEWARK: unknown
Q1 = crystal:CRYSTAL: CRYSTAL; OC_FARNELL: unknown; OC_NEWARK: unknown
R1 R2 = rcl:R-EU_: RESISTOR, European symbol
RN1 = resistor-dil:4R-N: Array Chip Resistor Source: RS Component / Phycomp; OC_FARNELL: unknown; OC_NEWARK: unknown
TP1-TP69 = testpad:TP: Test pad
U1 = SparkFun-Connectors:USB-AB: This is a USB AB connector that is compatible with USB OTG. i.e. this connector can serve as a host or device
U2 = esd:TPD3E001DRLR: LOW-CAPACITANCE 3-CHANNEL ±15-kV ESD-PROTECTION ARRAY FOR HIGH-SPEED DATA INTERFACES; MPN: TPD3E001DRLR; OC_FARNELL: 1603422; OC_NEWARK: 41M5842; PACKAGE: SOT-5; SUPPLIER: Texas Instruments
U$1 = KAC-12040:KAC-12040
U$2 = ft232h:FT232H: FTDI FT232H DS: http://www.ftdichip.com/Support/Documents/DataSheets/ICs/DS_FT232H.pdf
U$3 = IP4786CZ32:IP4786CZ32: IP4786CZ32 DVI AND HDMI interface ESD and overcurrent protection
U$4 = TXS02612:TXS02612
U$5 = adv7513:ADV7513
X1 X2 = con-garry:332-12: 12 Pin - 2mm Dual Row Source: www.mpe-connector.de / garry_shortform_2012.pdf
X3 = con-molex:52745-1690: FFC/FPC-to-Board 0.50mm (.020") SMT Top Contact Right Angle, ZIF, Style Receptacle 52745 / 52435 Source: http://www.molex.com/product/ffc/52745.html
X4 = con-molex:52745-1290: FFC/FPC-to-Board 0.50mm (.020") SMT Top Contact Right Angle, ZIF, Style Receptacle 52745 / 52435 Source: http://www.molex.com/product/ffc/52745.html
X5 = con-molex:52745-2490: FFC/FPC-to-Board 0.50mm (.020") SMT Top Contact Right Angle, ZIF, Style Receptacle 52745 / 52435 Source: http://www.molex.com/product/ffc/52745.html
ZED1 = microzed:µZ-FCI
µSD0 µSD1 = micro-sd:MICRO-SD

## Net classes
1 LVDS: width 0.305 mm, drill 0.305 mm, clearance 0.152 mm